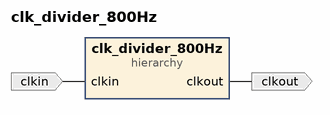
[diagram p0: block diagram of the top level]
# Vivado block design clk_divider_800Hz, xc7a35tcpg236-1, Vivado 2018.3
create_bd_design clk_divider_800Hz

create_bd_port -dir O clkout
create_bd_port -dir I clkin

create_bd_cell -type hier clk_divider_800Hz

# ---- hierarchy /clk_divider_800Hz ----
current_bd_instance /clk_divider_800Hz
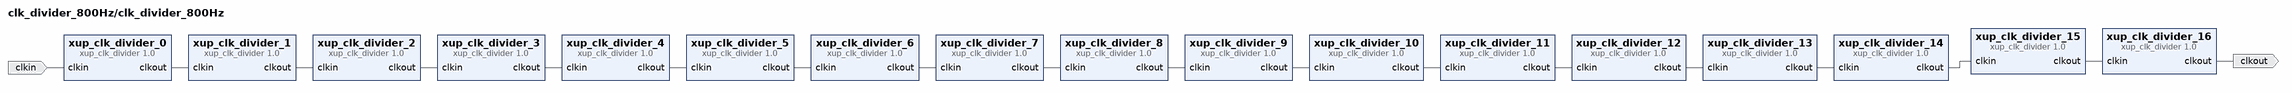
[diagram p1: block diagram inside /clk_divider_800Hz]
create_bd_pin -dir O clkout
create_bd_pin -dir I clkin

create_bd_cell -type ip -vlnv xilinx.com:xup:xup_clk_divider:1.0 xup_clk_divider_2
create_bd_cell -type ip -vlnv xilinx.com:xup:xup_clk_divider:1.0 xup_clk_divider_15
create_bd_cell -type ip -vlnv xilinx.com:xup:xup_clk_divider:1.0 xup_clk_divider_3
create_bd_cell -type ip -vlnv xilinx.com:xup:xup_clk_divider:1.0 xup_clk_divider_16
create_bd_cell -type ip -vlnv xilinx.com:xup:xup_clk_divider:1.0 xup_clk_divider_4
create_bd_cell -type ip -vlnv xilinx.com:xup:xup_clk_divider:1.0 xup_clk_divider_5
create_bd_cell -type ip -vlnv xilinx.com:xup:xup_clk_divider:1.0 xup_clk_divider_6
create_bd_cell -type ip -vlnv xilinx.com:xup:xup_clk_divider:1.0 xup_clk_divider_7
create_bd_cell -type ip -vlnv xilinx.com:xup:xup_clk_divider:1.0 xup_clk_divider_8
create_bd_cell -type ip -vlnv xilinx.com:xup:xup_clk_divider:1.0 xup_clk_divider_9
create_bd_cell -type ip -vlnv xilinx.com:xup:xup_clk_divider:1.0 xup_clk_divider_10
create_bd_cell -type ip -vlnv xilinx.com:xup:xup_clk_divider:1.0 xup_clk_divider_11
create_bd_cell -type ip -vlnv xilinx.com:xup:xup_clk_divider:1.0 xup_clk_divider_12
create_bd_cell -type ip -vlnv xilinx.com:xup:xup_clk_divider:1.0 xup_clk_divider_0
create_bd_cell -type ip -vlnv xilinx.com:xup:xup_clk_divider:1.0 xup_clk_divider_13
create_bd_cell -type ip -vlnv xilinx.com:xup:xup_clk_divider:1.0 xup_clk_divider_1
create_bd_cell -type ip -vlnv xilinx.com:xup:xup_clk_divider:1.0 xup_clk_divider_14

# ---- connections ----

current_bd_instance /clk_divider_800Hz
connect_bd_net [get_bd_pins xup_clk_divider_1/clkout] [get_bd_pins xup_clk_divider_2/clkin]
connect_bd_net [get_bd_pins xup_clk_divider_2/clkout] [get_bd_pins xup_clk_divider_3/clkin]
connect_bd_net [get_bd_pins xup_clk_divider_14/clkout] [get_bd_pins xup_clk_divider_15/clkin]
connect_bd_net [get_bd_pins xup_clk_divider_15/clkout] [get_bd_pins xup_clk_divider_16/clkin]
connect_bd_net [get_bd_pins xup_clk_divider_3/clkout] [get_bd_pins xup_clk_divider_4/clkin]
connect_bd_net [get_bd_pins xup_clk_divider_4/clkout] [get_bd_pins xup_clk_divider_5/clkin]
connect_bd_net [get_bd_pins xup_clk_divider_5/clkout] [get_bd_pins xup_clk_divider_6/clkin]
connect_bd_net [get_bd_pins xup_clk_divider_6/clkout] [get_bd_pins xup_clk_divider_7/clkin]
connect_bd_net [get_bd_pins xup_clk_divider_7/clkout] [get_bd_pins xup_clk_divider_8/clkin]
connect_bd_net [get_bd_pins xup_clk_divider_8/clkout] [get_bd_pins xup_clk_divider_9/clkin]
connect_bd_net [get_bd_pins xup_clk_divider_9/clkout] [get_bd_pins xup_clk_divider_10/clkin]
connect_bd_net [get_bd_pins xup_clk_divider_10/clkout] [get_bd_pins xup_clk_divider_11/clkin]
connect_bd_net [get_bd_pins xup_clk_divider_11/clkout] [get_bd_pins xup_clk_divider_12/clkin]
connect_bd_net [get_bd_pins xup_clk_divider_12/clkout] [get_bd_pins xup_clk_divider_13/clkin]
connect_bd_net [get_bd_pins xup_clk_divider_0/clkout] [get_bd_pins xup_clk_divider_1/clkin]
connect_bd_net [get_bd_pins xup_clk_divider_13/clkout] [get_bd_pins xup_clk_divider_14/clkin]
connect_bd_net [get_bd_pins xup_clk_divider_16/clkout] [get_bd_pins clkout]
connect_bd_net -net clkin_0_1 [get_bd_pins clkin] [get_bd_pins xup_clk_divider_0/clkin]

current_bd_instance /
connect_bd_net -net xup_clk_divider_16_clkout [get_bd_pins clk_divider_800Hz/clkout] [get_bd_ports clkout]
connect_bd_net -net clkin_0_1 [get_bd_ports clkin] [get_bd_pins clk_divider_800Hz/clkin]

validate_bd_design
save_bd_design
